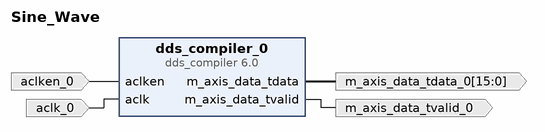
[diagram p0: block diagram of the top level]
# Vivado block design Sine_Wave, xc7a35tcpg236-1, Vivado 2018.2
create_bd_design Sine_Wave

create_bd_port -dir I -type ce aclken_0
create_bd_port -dir I -type clk aclk_0
create_bd_port -dir O -from 15 -to 0 m_axis_data_tdata_0
create_bd_port -dir O m_axis_data_tvalid_0

create_bd_cell -type ip -vlnv xilinx.com:ip:dds_compiler:6.0 dds_compiler_0
set_property -dict [list \
  CONFIG.Spurious_Free_Dynamic_Range 96 \
  CONFIG.Noise_Shaping Auto \
  CONFIG.Phase_Width 28 \
  CONFIG.Output_Width 16 \
  CONFIG.Output_Selection Sine \
  CONFIG.Has_Phase_Out false \
  CONFIG.M_DATA_Has_TUSER Not_Required \
  CONFIG.Latency 8 \
  CONFIG.Has_ACLKEN true \
  CONFIG.Output_Frequency1 0.002 \
  CONFIG.PINC1 1010011111000 \
] [get_bd_cells dds_compiler_0]

# ---- connections ----

connect_bd_net -net aclken_0_1 [get_bd_ports aclken_0] [get_bd_pins dds_compiler_0/aclken]
connect_bd_net -net aclk_0_1 [get_bd_ports aclk_0] [get_bd_pins dds_compiler_0/aclk]
connect_bd_net [get_bd_pins dds_compiler_0/m_axis_data_tdata] [get_bd_ports m_axis_data_tdata_0]
connect_bd_net [get_bd_pins dds_compiler_0/m_axis_data_tvalid] [get_bd_ports m_axis_data_tvalid_0]

validate_bd_design
save_bd_design
